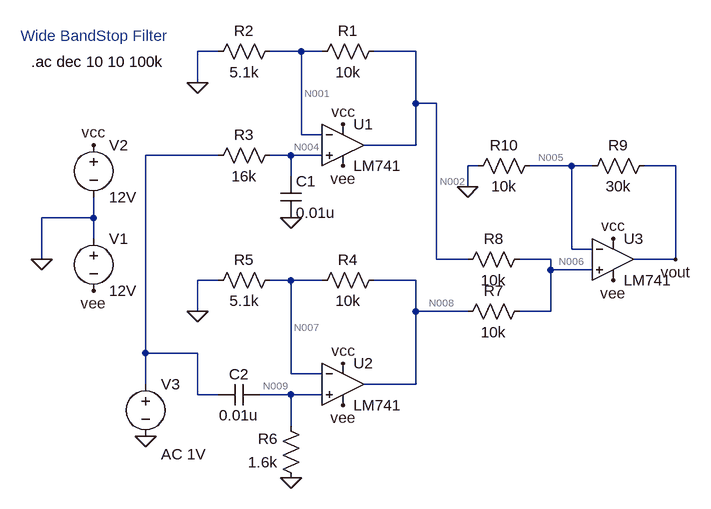
[diagram p0: schematic wide_band_stop.asc]
wide_band_stop.asc, the LTspice schematic file:
Version 4.1
SHEET 1 956 680
WIRE 208 -112 176 -112
WIRE 336 -112 288 -112
WIRE 368 -112 336 -112
WIRE 512 -112 448 -112
WIRE 176 -64 176 -112
WIRE 512 -32 512 -112
WIRE 544 -32 512 -32
WIRE 336 16 336 -112
WIRE 368 16 336 16
WIRE 512 32 512 -32
WIRE 512 32 432 32
WIRE 208 48 96 48
WIRE 320 48 288 48
WIRE 368 48 320 48
WIRE 608 64 592 64
WIRE 752 64 688 64
WIRE 784 64 752 64
WIRE 912 64 864 64
WIRE 320 80 320 48
WIRE 592 96 592 64
WIRE 16 144 16 112
WIRE 16 144 -64 144
WIRE 16 176 16 144
WIRE 752 192 752 64
WIRE 784 192 752 192
WIRE -64 208 -64 144
WIRE 544 208 544 -32
WIRE 592 208 544 208
WIRE 720 208 672 208
WIRE 912 208 912 64
WIRE 912 208 848 208
WIRE 720 224 720 208
WIRE 784 224 720 224
WIRE 208 240 176 240
WIRE 320 240 288 240
WIRE 368 240 320 240
WIRE 512 240 448 240
WIRE 176 288 176 240
WIRE 512 288 512 240
WIRE 592 288 512 288
WIRE 720 288 720 224
WIRE 720 288 672 288
WIRE 96 352 96 48
WIRE 176 352 96 352
WIRE 320 384 320 240
WIRE 368 384 320 384
WIRE 96 400 96 352
WIRE 512 400 512 288
WIRE 512 400 432 400
WIRE 176 416 176 352
WIRE 208 416 176 416
WIRE 320 416 272 416
WIRE 368 416 320 416
WIRE 320 464 320 416
FLAG -64 208 0
FLAG 16 32 vcc
FLAG 400 0 vcc
FLAG 400 368 vcc
FLAG 816 176 vcc
FLAG 16 256 vee
FLAG 400 432 vee
FLAG 816 240 vee
FLAG 400 64 vee
FLAG 176 -64 0
FLAG 176 288 0
FLAG 592 96 0
FLAG 96 480 0
FLAG 320 144 0
FLAG 320 544 0
FLAG 912 208 vout
SYMBOL voltage 16 160 R0
WINDOW 123 0 0 Left 0
WINDOW 39 0 0 Left 0
SYMATTR InstName V1
SYMATTR Value 12V
SYMBOL voltage 16 16 R0
WINDOW 123 0 0 Left 0
WINDOW 39 0 0 Left 0
SYMATTR InstName V2
SYMATTR Value 12V
SYMBOL LM741 400 -32 R0
SYMATTR InstName U1
SYMBOL LM741 400 336 R0
SYMATTR InstName U2
SYMBOL LM741 816 144 R0
SYMATTR InstName U3
SYMBOL res 464 -128 R90
WINDOW 0 0 56 VBottom 2
WINDOW 3 32 56 VTop 2
SYMATTR InstName R1
SYMATTR Value 10k
SYMBOL res 304 -128 R90
WINDOW 0 0 56 VBottom 2
WINDOW 3 32 56 VTop 2
SYMATTR InstName R2
SYMATTR Value 5.1k
SYMBOL res 304 32 R90
WINDOW 0 0 56 VBottom 2
WINDOW 3 32 56 VTop 2
SYMATTR InstName R3
SYMATTR Value 16k
SYMBOL res 464 224 R90
WINDOW 0 0 56 VBottom 2
WINDOW 3 32 56 VTop 2
SYMATTR InstName R4
SYMATTR Value 10k
SYMBOL res 304 224 R90
WINDOW 0 0 56 VBottom 2
WINDOW 3 32 56 VTop 2
SYMATTR InstName R5
SYMATTR Value 5.1k
SYMBOL res 336 560 R180
WINDOW 0 36 76 Left 2
WINDOW 3 36 40 Left 2
SYMATTR InstName R6
SYMATTR Value 1.6k
SYMBOL res 576 304 R270
WINDOW 0 32 56 VTop 2
WINDOW 3 0 56 VBottom 2
SYMATTR InstName R7
SYMATTR Value 10k
SYMBOL res 576 224 R270
WINDOW 0 32 56 VTop 2
WINDOW 3 0 56 VBottom 2
SYMATTR InstName R8
SYMATTR Value 10k
SYMBOL res 768 80 R270
WINDOW 0 32 56 VTop 2
WINDOW 3 0 56 VBottom 2
SYMATTR InstName R9
SYMATTR Value 30k
SYMBOL res 592 80 R270
WINDOW 0 32 56 VTop 2
WINDOW 3 0 56 VBottom 2
SYMATTR InstName R10
SYMATTR Value 10k
SYMBOL cap 304 80 R0
SYMATTR InstName C1
SYMATTR Value 0.01u
SYMBOL cap 272 400 R90
WINDOW 0 0 32 VBottom 2
WINDOW 3 32 32 VTop 2
SYMATTR InstName C2
SYMATTR Value 0.01u
SYMBOL voltage 96 384 R0
WINDOW 123 24 124 Left 2
WINDOW 39 0 0 Left 0
SYMATTR InstName V3
SYMATTR Value ""
SYMATTR Value2 AC 1V
TEXT -96 -136 Left 2 ;Wide BandStop Filter
TEXT -80 -96 Left 2 !.ac dec 10 10 100k

The netlist it stands for:
* wide_band_stop.asc
V1 0 vee 12V
V2 vcc 0 12V
X§U1 N004 N001 vcc vee N002 LM741  ; pins In+ In- V+ V- OUT
X§U2 N009 N007 vcc vee N008 LM741  ; pins In+ In- V+ V- OUT
X§U3 N006 N005 vcc vee vout LM741  ; pins In+ In- V+ V- OUT
R1 N002 N001 10k
R2 N001 0 5.1k
R3 N004 N003 16k
R4 N008 N007 10k
R5 N007 0 5.1k
R6 0 N009 1.6k
R7 N008 N006 10k
R8 N002 N006 10k
R9 N005 vout 30k
R10 0 N005 10k
C1 N004 0 0.01u
C2 N009 N003 0.01u
V3 N003 0 AC 1V
* Wide BandStop Filter
.ac dec 10 10 100k
.lib LM741.lib
.backanno
.end

* Results of the author's LTspice run, read from the files saved beside the schematic
* Operating Point, zero values left out:
*   V(vcc) = 12 V
*   V(n001) = 74.2 µV
*   V(n002) = 1.238 mV
*   V(n007) = 907.4 µV
*   V(n005) = 3.182 mV
*   V(vee) = -12 V
*   V(n004) = -925.8 µV
*   V(n009) = -92.58 µV
*   V(n008) = 3.705 mV
*   V(n006) = 2.182 mV
*   V(vout) = 15.79 mV
*   I(V1) = -4.878 mA
*   I(R3) = -57.86 nA
*   I(R4) = 279.8 nA
*   I(R6) = 57.86 nA
*   I(R9) = -420.1 nA
*   I(R1) = 116.4 nA
*   I(R2) = 14.55 nA
*   I(R5) = 177.9 nA
*   I(R7) = 152.3 nA
*   I(R8) = -94.42 nA
*   I(R10) = -318.2 nA
*   I(V2) = -4.879 mA
*   I(V3) = -57.86 nA
*   Ix(u2:1) = 57.86 nA
*   Ix(u2:2) = 101.9 nA
*   Ix(u2:99) = 1.626 mA
*   Ix(u2:50) = -1.626 mA
*   Ix(u2:28) = -432.1 nA
*   Ix(u1:1) = 57.86 nA
*   Ix(u1:2) = 101.9 nA
*   Ix(u1:99) = 1.626 mA
*   Ix(u1:50) = -1.626 mA
*   Ix(u1:28) = -21.99 nA
*   Ix(u3:1) = 57.86 nA
*   Ix(u3:2) = 101.9 nA
*   Ix(u3:99) = 1.626 mA
*   Ix(u3:50) = -1.626 mA
*   Ix(u3:28) = -420.1 nA